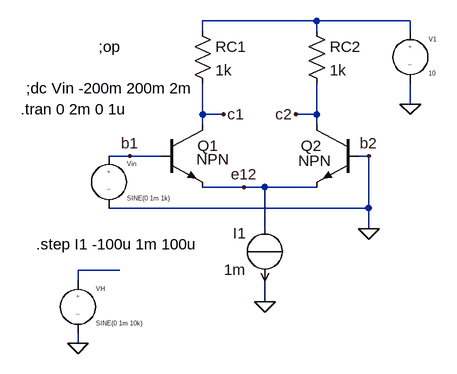
[diagram p0: schematic diff-linear.asc]
diff-linear.asc, the LTspice schematic file:
Version 4
SHEET 1 880 680
WIRE 368 -48 192 -48
WIRE 512 -48 368 -48
WIRE 192 -32 192 -48
WIRE 368 -32 368 -48
WIRE 512 -32 512 -48
WIRE 512 80 512 48
WIRE 192 96 192 48
WIRE 224 96 192 96
WIRE 368 96 368 48
WIRE 368 96 336 96
WIRE 192 112 192 96
WIRE 368 112 368 96
WIRE 80 160 48 160
WIRE 128 160 80 160
WIRE 448 160 432 160
WIRE 256 208 192 208
WIRE 288 208 256 208
WIRE 368 208 288 208
WIRE 448 240 448 160
WIRE 448 240 48 240
WIRE 288 272 288 208
WIRE 448 272 448 240
WIRE 64 336 0 336
WIRE 0 352 0 336
WIRE 288 384 288 352
WIRE 0 448 0 432
FLAG 288 384 0
FLAG 512 80 0
FLAG 224 96 c1
FLAG 336 96 c2
FLAG 80 160 b1
FLAG 448 160 b2
FLAG 256 208 e12
FLAG 448 272 0
FLAG 0 448 0
SYMBOL EIT_Semiconductors\\npn 128 112 R0
WINDOW 3 55 53 Left 2
SYMATTR InstName Q1
SYMBOL EIT_Semiconductors\\npn 432 112 M0
WINDOW 3 42 55 Left 2
SYMATTR InstName Q2
SYMBOL source-I 288 352 R180
WINDOW 0 29 73 Left 2
WINDOW 3 29 17 Left 2
SYMATTR InstName I1
SYMATTR Value 1m
SYMBOL source-V 48 144 R0
WINDOW 123 0 0 Left 2
WINDOW 39 0 0 Left 2
SYMATTR InstName Vin
SYMATTR Value SINE(0 1m 1k)
SYMBOL res 176 -48 R0
SYMATTR InstName RC1
SYMATTR Value 1k
SYMBOL res 352 -48 R0
SYMATTR InstName RC2
SYMATTR Value 1k
SYMBOL source-V 512 -48 R0
SYMATTR InstName V1
SYMATTR Value 10
SYMBOL source-V 0 336 R0
WINDOW 123 0 0 Left 2
WINDOW 39 0 0 Left 2
SYMATTR InstName VH
SYMATTR Value SINE(0 1m 10k)
TEXT 32 -8 Left 2 !;op
TEXT -80 56 Left 2 !;dc Vin -200m 200m 2m
TEXT -88 88 Left 2 !.tran 0 2m 0 1u
TEXT -64 296 Left 2 !.step I1 -100u 1m 100u

The netlist it stands for:
* diff-linear.asc
Q1 c1 b1 e12 0 NPN
Q2 c2 0 e12 0 NPN
I1 e12 0 1m
Vin b1 0 SINE(0 1m 1k)
RC1 N001 c1 1k
RC2 N001 c2 1k
V1 N001 0 10
VH N002 0 SINE(0 1m 10k)
.model NPN NPN
.model PNP PNP
.lib standard.bjt
;op
;dc Vin -200m 200m 2m
.tran 0 2m 0 1u
.step I1 -100u 1m 100u
.backanno
.end